# Altium schematic sheet MotoAVC - Aquisição.SchDoc: MotoAVC v1.0
size A4; Author: Felippe Kalil Mendonça; DrawnBy: Felippe Kalil Mendonça; Organization: LABSOLDA/UFSC; Address1: Campus Universitário; Address2: Trindade - Florianópolis - SC; Address3: Brasil; DocumentNumber: 1.0; SheetNumber: 1; SheetTotal: 1; ProjectName: MotoAVC
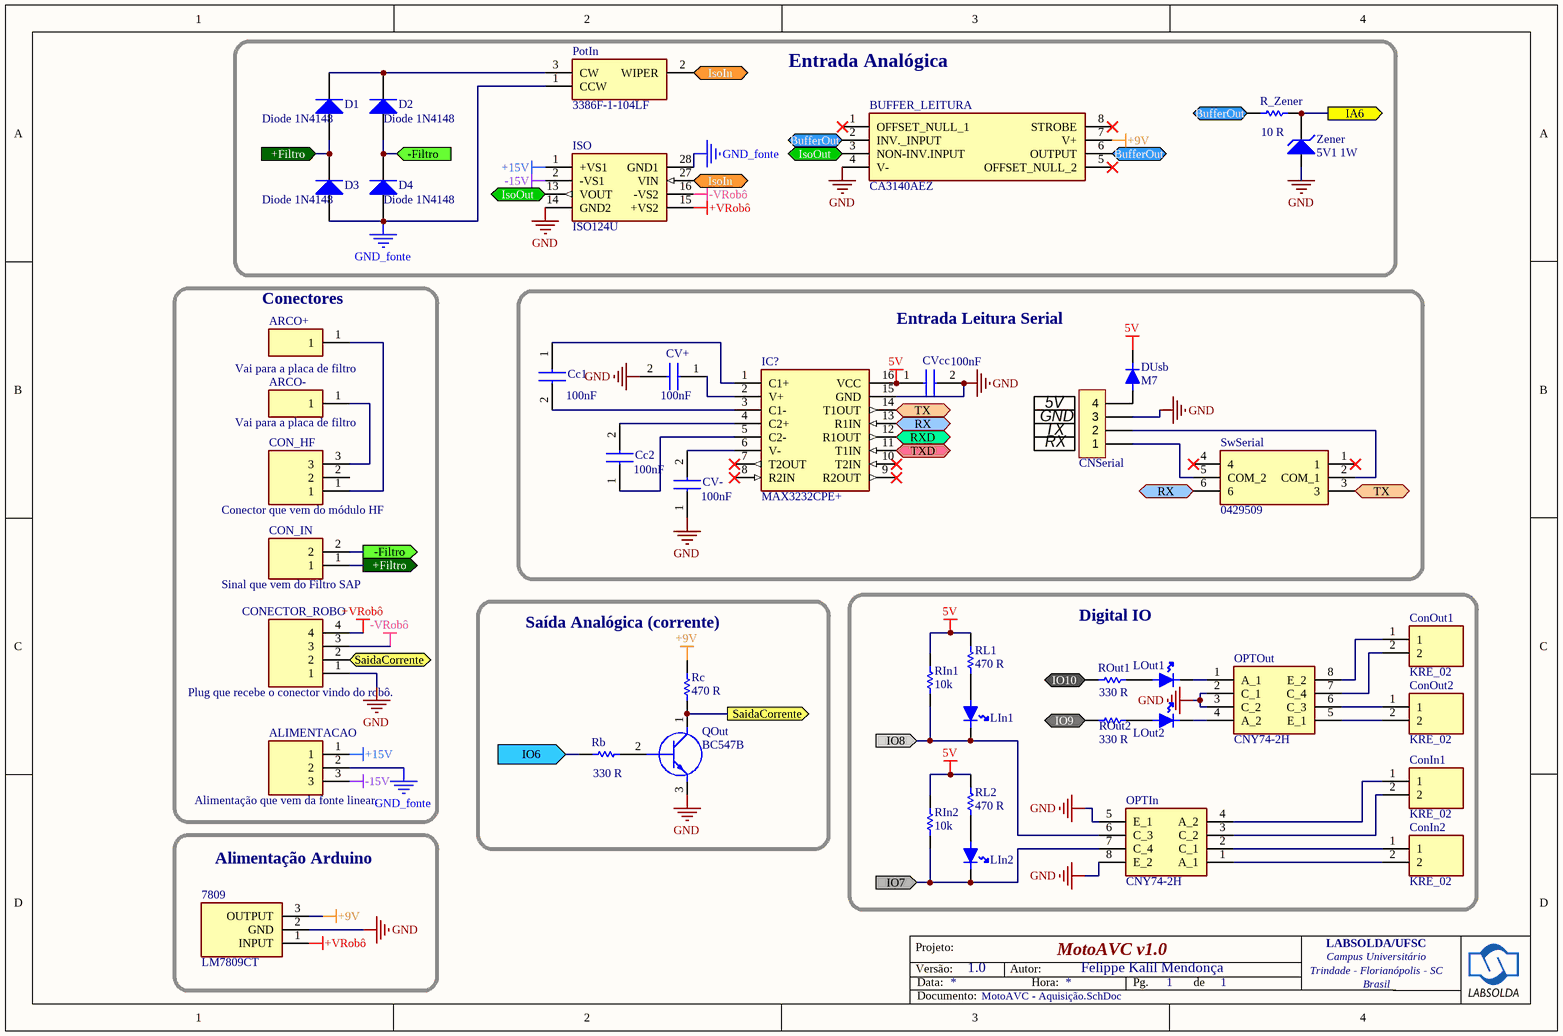
[diagram p0: MotoAVC - Aquisição.SchDoc]

## Parts
7809  LM7809CT  [TO254P470X1016X2019-3P]
ALIMENTACAO  Alimentação que vem da fonte linear.  [0022053031]
ARCO+  Vai para a placa de filtro  [CT22320]
ARCO-  Vai para a placa de filtro  [CT22320]
BUFFER_LEITURA  CA3140AEZ  [DIP794W56P254L958H533Q8N]
Cc1  100nF  [R82DC4100DQ60J]
Cc2  100nF  [R82DC4100DQ60J]
CNSerial  STLZ 4 Vias  [STLZ 4 5.08mm]  (value not drawn)
CON_HF  Conector que vem do módulo HF  [37453]
CON_IN  Sinal que vem do Filtro SAP  [KRE02]
CONECTOR_ROBO  Plug que recebe o conector vindo do robô.  [SHDR4W87P0X254_1X4_1001X635X1091P]
ConIn1  KRE_02  [KRE02]
ConIn2  KRE_02  [KRE02]
ConOut1  KRE_02  [KRE02]
ConOut2  KRE_02  [KRE02]
CV+  100nF  [R82DC4100DQ60J]
CV-  100nF  [R82DC4100DQ60J]
CVcc  100nF  [R82DC4100DQ60J]
D1  Diode 1N4148  [DO-35]
D2  Diode 1N4148  [DO-35]
D3  Diode 1N4148  [DO-35]
D4  Diode 1N4148  [DO-35]
DUsb  M7  [DO-214AC SMA]
IC?  MAX3232CPE+  [DIP762W56P254L1918H457Q16N]
ISO  ISO124U  [ISO122U]
LIn1  Led_Green_0603  [Green Led 0603]  (value not drawn)
LIn2  Led_Green_0603  [Green Led 0603]  (value not drawn)
LOut1  Led_Green_0603  [Green Led 0603]  (value not drawn)
LOut2  Led_Green_0603  [Green Led 0603]  (value not drawn)
OPTIn  CNY74-2H  [DIP762W56P254L977H470Q8N]
OPTOut  CNY74-2H  [DIP762W56P254L977H470Q8N]
PotIn  3386F-1-104LF  [3386F1153]
QOut  BC547B  [TO127P419X482X1041-3P]
R_Zener  value 10 R  [AXIAL-0.3]
Rb  value 330 R  [AXIAL-0.3]
Rc  value 470 R  [AXIAL-0.3]
RIn1  value 10k  [AXIAL-0.3]
RIn2  value 10k  [AXIAL-0.3]
RL1  value 470 R  [AXIAL-0.3]
RL2  value 470 R  [AXIAL-0.3]
ROut1  value 330 R  [AXIAL-0.3]
ROut2  value 330 R  [AXIAL-0.3]
SwSerial  0429509  [0429509]
Zener  5V1 1W  [DIODE-0.7]

## Blocks framed on the sheet
Entrada Analógica: BUFFER_LEITURA D1-D4 ISO PotIn R_Zener Zener
Conectores: ALIMENTACAO ARCO+ ARCO- CON_HF CON_IN CONECTOR_ROBO
Saída Analógica (corrente): QOut Rb Rc
Digital IO: ConIn1 ConIn2 ConOut1 ConOut2 LIn1 LIn2 LOut1 LOut2 OPTIn OPTOut RIn1 RIn2 RL1 RL2 ROut1 ROut2
Alimentação Arduino: 7809

## Ports
+Filtro (in), +Filtro (out), -Filtro (in), -Filtro (out), BufferOut (in), BufferOut (out), IA6 (out), IO6 (in), IO7 (in), IO8 (in), IO9 (in), IO10 (in), IsoIn (in), IsoIn (out), IsoOut (out), RX (in), RX (out), RXD (out), SaidaCorrente (in), SaidaCorrente (out), TX (in), TX (out), TXD (in)

## Nets
5V: CVcc.1 DUsb.K IC?.16(VCC) RIn1.1 RIn2.1 RL1.1 RL2.1
+9V: 7809.3(OUTPUT) BUFFER_LEITURA.7(V+) Rc.2
+15V: ALIMENTACAO.1 ISO.1(+VS1)
+VRobô: 7809.1(INPUT) CONECTOR_ROBO.4 ISO.15(+VS2)
-15V: ALIMENTACAO.3 ISO.2(-VS1)
-VRobô: CONECTOR_ROBO.3 ISO.16(-VS2)
GND: 7809.2(GND) BUFFER_LEITURA.4(V-) CNSerial.3 CONECTOR_ROBO.1 CV+.2 CV-.1 CVcc.2 IC?.15(GND) ISO.14(GND2) OPTIn.5(E_1) OPTIn.8(E_2) OPTOut.2(C_1) OPTOut.3(C_2) QOut.3(E) Zener.1(A)
GND_fonte: ALIMENTACAO.2 D3.1(A) D4.1(A) ISO.28(GND1) PotIn.1(CCW)
+Filtro: CON_IN.1 D1.1(A) D3.2(K) ; port +Filtro
-Filtro: CON_IN.2 D2.1(A) D4.2(K) ; port -Filtro
BufferOut: BUFFER_LEITURA.2(INV._INPUT) BUFFER_LEITURA.6(OUTPUT) R_Zener.1 ; port BufferOut
IA6: R_Zener.2 Zener.2(K) ; port IA6
IO6: Rb.1 ; port IO6
IO7: LIn2.K OPTIn.7(C_4) RIn2.2 ; port IO7
IO8: LIn1.K OPTIn.6(C_3) RIn1.2 ; port IO8
IO9: ROut2.1 ; port IO9
IO10: ROut1.1 ; port IO10
IsoIn: ISO.27(VIN) PotIn.2(WIPER) ; port IsoIn
IsoOut: BUFFER_LEITURA.3(NON-INV.INPUT) ISO.13(VOUT) ; port IsoOut
RX: IC?.13(R1IN) SwSerial.6 ; port RX
RXD: IC?.12(R1OUT) ; port RXD
SaidaCorrente: CONECTOR_ROBO.2 QOut.1(C) Rc.1 ; port SaidaCorrente
TX: IC?.14(T1OUT) SwSerial.3 ; port TX
TXD: IC?.11(T1IN) ; port TXD
NetARCO+_1: ARCO+.1 CON_HF.1
NetARCO-_1: ARCO-.1 CON_HF.3
NetCc1_1: Cc1.1 IC?.1(C1+)
NetCc1_2: Cc1.2 IC?.3(C1-)
NetCc2_1: Cc2.1 IC?.5(C2-)
NetCc2_2: Cc2.2 IC?.4(C2+)
NetCNSerial_1: CNSerial.1 SwSerial.5(COM_2)
NetCNSerial_2: CNSerial.2 SwSerial.2(COM_1)
NetCNSerial_4: CNSerial.4 DUsb.A
NetConIn1_1: ConIn1.1 OPTIn.4(A_2)
NetConIn1_2: ConIn1.2 OPTIn.3(C_2)
NetConIn2_1: ConIn2.1 OPTIn.2(C_1)
NetConIn2_2: ConIn2.2 OPTIn.1(A_1)
NetConOut1_1: ConOut1.1 OPTOut.8(E_2)
NetConOut1_2: ConOut1.2 OPTOut.7(C_4)
NetConOut2_1: ConOut2.1 OPTOut.6(C_3)
NetConOut2_2: ConOut2.2 OPTOut.5(E_1)
NetCV+_1: CV+.1 IC?.2(V+)
NetCV-_2: CV-.2 IC?.6(V-)
NetD1_2: D1.2(K) D2.2(K) PotIn.3(CW)
NetLIn1_A: LIn1.A RL1.2
NetLIn2_A: LIn2.A RL2.2
NetLOut1_A: LOut1.A ROut1.2
NetLOut1_K: LOut1.K OPTOut.1(A_1)
NetLOut2_A: LOut2.A ROut2.2
NetLOut2_K: LOut2.K OPTOut.4(A_2)
NetQOut_2: QOut.2(B) Rb.2

Not connected (* = marked no-connect by the designer): BUFFER_LEITURA 1(OFFSET_NULL_1)* 5(OFFSET_NULL_2)* 8(STROBE)*; CON_HF 2; IC? 7(T2OUT)* 8(R2IN)* 9(R2OUT)* 10(T2IN)*; SwSerial 1* 4*

## Notes on the sheet
- Entrada Leitura Serial
- (near CNSerial) GND
- (near CNSerial) 5V
- (near CNSerial) TX
- (near CNSerial) RX
- Versão:
- Projeto:
- Data:
- Autor:
- Hora:
- Pg.
- de
- Documento:

## Library data of the parts
7809 = LM7809CT: Alimentação Arduino (Vin); Manufacturer_Name: ON Semiconductor; Datasheet Link: https://mouser.componentsearchengine.com/Datasheets/2/LM7809CT.pdf; Height: 4.7mm; Manufacturer_Part_Number: LM7809CT; Arrow Part Number: LM7809CT; Arrow Price/Stock: https://www.arrow.com/en/products/lm7809ct/on-semiconductor; Mouser Part Number: 512-LM7809CT; Mouser Price/Stock: https://www.mouser.co.uk/ProductDetail/ON-Semiconductor-Fairchild/LM7809CT?qs=VOMQJJE%252BBNmmTueoZonUjQ%3D%3D
ALIMENTACAO = 0022053031: Connector; Manufacturer_Name: Molex; Datasheet Link: https://www.molex.com/pdm_docs/sd/022053031_sd.pdf; Height: 6.6mm; Manufacturer_Part_Number: 0022053031; Arrow Part Number: 0022053031; Arrow Price/Stock: https://www.arrow.com/en/products/0022053031/molex; Mouser Part Number: N/A; Mouser Price/Stock: https://www.mouser.com/Search/Refine.aspx?Keyword=N%2FA
ARCO+ ARCO- = CT2232-0: Connector; Manufacturer_Name: Cal Test; Datasheet Link: http://www.caltestelectronics.com/images/attachments/CT2232_drawing.pdf; Height: 38.3mm; Manufacturer_Part_Number: CT2232-0; Mouser Part Number: 510-CT2232-0; Mouser Price/Stock: https://www.mouser.co.uk/ProductDetail/Cal-Test/CT2232-0?qs=vgjKjNJexThptfwlH17E%2Fw%3D%3D
BUFFER_LEITURA = CA3140AEZ: Integrated Circuit; Manufacturer_Name: Renesas Electronics; Datasheet Link: https://www.renesas.com/en-us/www/doc/datasheet/ca3140-a.pdf; Height: 5.33mm; Manufacturer_Part_Number: CA3140AEZ; Mouser Part Number: 968-CA3140AEZ; Mouser Price/Stock: https://www.mouser.co.uk/ProductDetail/Renesas-Intersil/CA3140AEZ?qs=cbl4%252BYHJGOHUlWz8IZgCeg%3D%3D; RS Part Number: 9215563P; RS Price/Stock: http://uk.rs-online.com/web/p/products/9215563P
Cc1 Cc2 CV+ CV- CVcc = R82DC4100DQ60J: Capacitor; Manufacturer_Name: Kemet; Allied_Number: 70037793; Datasheet Link: https://content.kemet.com/datasheets/KEM_F3101_R82.pdf; Height: 10.1mm; Manufacturer_Part_Number: R82DC4100DQ60J; Mouser Part Number: 80-R82DC4100DQ60J; Mouser Price/Stock: https://www.mouser.co.uk/ProductDetail/KEMET/R82DC4100DQ60J?qs=06HLYMEcjuVd2Wr1NUYuhw%3D%3D; RS Part Number: 8708834; RS Price/Stock: http://uk.rs-online.com/web/p/products/8708834; Allied Price/Stock: https://www.alliedelec.com/kemet-r82dc4100dq60j/70037793/
CNSerial = STLZ 4 Vias: Conector Socket STLZ 4 Vias 5.08mm
CON_HF = 37.453: Connector; Manufacturer_Name: Altech; Datasheet Link: https://www.mouser.com/datasheet/2/16/PCBUS-32235.pdf; Height: 8.4mm; Manufacturer_Part_Number: 37.453; Mouser Part Number: 845-37.453; Mouser Price/Stock: https://www.mouser.co.uk/ProductDetail/Altech/37453?qs=%2FoOZWyheKh%252B2r3A%252BF8hJwQ%3D%3D
CON_IN ConIn1 ConIn2 ConOut1 ConOut2 = KRE_02: Connector; Manufacturer_Name: LUMBERG; Manufacturer_Part_Number: KRE 02; Datasheet Link: https://componentsearchengine.com/Datasheets/2/KRE 02.pdf; Height: 15.5mm; Arrow Part Number: KRE 02; Arrow Price/Stock: https://www.arrow.com/en/products/kre02/lumberg
CONECTOR_ROBO = 0022232041: Connector; Manufacturer_Name: Molex; Datasheet Link: http://www.molex.com/pdm_docs/sd/022232041_sd.pdf; Height: 10.91mm; Manufacturer_Part_Number: 0022232041; Mouser Part Number: N/A; Mouser Price/Stock: https://www.mouser.com/Search/Refine.aspx?Keyword=N%2FA
D1-D4 = Diode 1N4148: High Conductance Fast Diode; Published: 8-Jun-2000; LatestRevisionDate: 17-Jul-2002; LatestRevisionNote: Re-released for DXP Platform.; DatasheetVersion: 1997; PackageReference: DO-35; Publisher: Altium Limited; PackageDescription: Diode, Axial; Body 3.8 x 1.9 mm (LxDia. max), Lead Dia. 0.53 mm (max); Code_JEDEC: DO-204-AH; ComponentLink1Description: Manufacturer Link; ComponentLink1URL: http://www.fairchildsemi.com/; ComponentLink2Description: Datasheet; ComponentLink2URL: http://www.fairchildsemi.com/ds/1N%2F1N4148.pdf
DUsb = M7: 1A Rectifier Diodes
IC? = MAX3232CPE+: Integrated Circuit; Manufacturer_Name: Maxim Integrated; Datasheet Link: http://datasheets.maximintegrated.com/en/ds/MAX3222-MAX3241.pdf; Height: 4.572mm; Manufacturer_Part_Number: MAX3232CPE+; Mouser Part Number: 700-MAX3232CPE; Mouser Price/Stock: https://www.mouser.com/Search/Refine.aspx?Keyword=700-MAX3232CPE; RS Part Number: 1897981; RS Price/Stock: http://uk.rs-online.com/web/p/products/1897981
ISO = ISO124U: Integrated Circuit; Manufacturer_Name: Texas Instruments; Datasheet Link: http://www.ti.com/lit/ds/symlink/iso124.pdf; Height: 2.65mm; Manufacturer_Part_Number: ISO124U; Mouser Part Number: 595-ISO124U; Mouser Price/Stock: https://www.mouser.co.uk/ProductDetail/Texas-Instruments/ISO124U?qs=VBduBm9rCJQZw7ykoQ%2Fz8g%3D%3D; RS Part Number: 3008259P; RS Price/Stock: http://uk.rs-online.com/web/p/products/3008259P
LIn1 LIn2 LOut1 LOut2 = Green 0603: LED GREEN CLEAR 0603 SMD PN 150060VS75000
OPTIn OPTOut = CNY74-2H: Transistor; Manufacturer_Name: Vishay; Datasheet Link: https://componentsearchengine.com/Datasheets/2/CNY74-2H.pdf; Height: 4.7mm; Manufacturer_Part_Number: CNY74-2H; Arrow Part Number: CNY74-2H; Arrow Price/Stock: https://www.arrow.com/en/products/cny74-2h/vishay; Mouser Part Number: 782-CNY74-2H; Mouser Price/Stock: https://www.mouser.co.uk/ProductDetail/Vishay-Semiconductors/CNY74-2H?qs=xCMk%252BIHWTZO%2Fp2dB7mb0lQ%3D%3D
PotIn = 3386F-1-104LF: Variable Resistor; Manufacturer_Name: Bourns; Datasheet Link: https://www.mouser.co.uk/datasheet/2/54/386-776606.pdf; Height: 4.83mm; Manufacturer_Part_Number: 3386F-1-104LF; Arrow Part Number: 3386F-1-104LF; Arrow Price/Stock: https://www.arrow.com/en/products/3386f-1-104lf/bourns; Mouser Part Number: 652-3386F-1-104LF; Mouser Price/Stock: https://www.mouser.co.uk/ProductDetail/Bourns/3386F-1-104LF?qs=nE0RJHjSZ6WRN3%252BQY8LjDg%3D%3D
QOut = BC547B: Transistor BJT NPN; Manufacturer_Name: ON Semiconductor; Datasheet Link: http://www.onsemi.com/pub/Collateral/BC546-D.PDF; Height: 4.19mm; Manufacturer_Part_Number: BC547B; Arrow Part Number: BC547B; Arrow Price/Stock: https://www.arrow.com/en/products/bc547b/on-semiconductor; Mouser Part Number: 512-BC547B; Mouser Price/Stock: https://www.mouser.co.uk/ProductDetail/ON-Semiconductor-Fairchild/BC547B?qs=UMEuL5FsraB3zD25tclGGQ%3D%3D
R_Zener Rb Rc RIn1 RIn2 RL1 RL2 ROut1 ROut2 = Res1: Resistor; Published: 8-Jun-2000; LatestRevisionDate: 17-Jul-2002; LatestRevisionNote: Re-released for DXP Platform.; PackageReference: AXIAL-0.3; Publisher: Altium Limited; PackageDescription: Axial Device, Thru-Hole; 2 Leads; 0.3 in Pin Spacing
SwSerial = 0429509: Chave que libera a gravação; Manufacturer_Name: RS Components; Datasheet Link: https://docs-emea.rs-online.com/webdocs/1582/0900766b81582d9d.pdf; Height: 12.3mm; Manufacturer_Part_Number: 0429509
Zener = D Zener: Published: 8-Jun-2000; LatestRevisionDate: 17-Jul-2002; LatestRevisionNote: Re-released for DXP Platform.; PackageReference: DIODE-0.7; Publisher: Altium Limited; PackageDescription: Diode, Thru-Hole; 2 Leads; 0.7 in Pin Spacing